# Altium schematic sheet NNP-DWG-165-001-000 BP2 Microcontroller Pg 3 of 6.SchDoc
size 431 x 279 mm; Organization: ORGANIZATION; Address1: ADDRESS 1; Address2: ADDRESS 2; Address3: ADDRESS 3; Address4: ADDRESS 4; Revision: -; SheetNumber: 4; SheetTotal: 6; ENG_APP_DATE: --/--/--; DSN_APP_DATE: --/--/--; CHK_APP_DATE: --/--/--
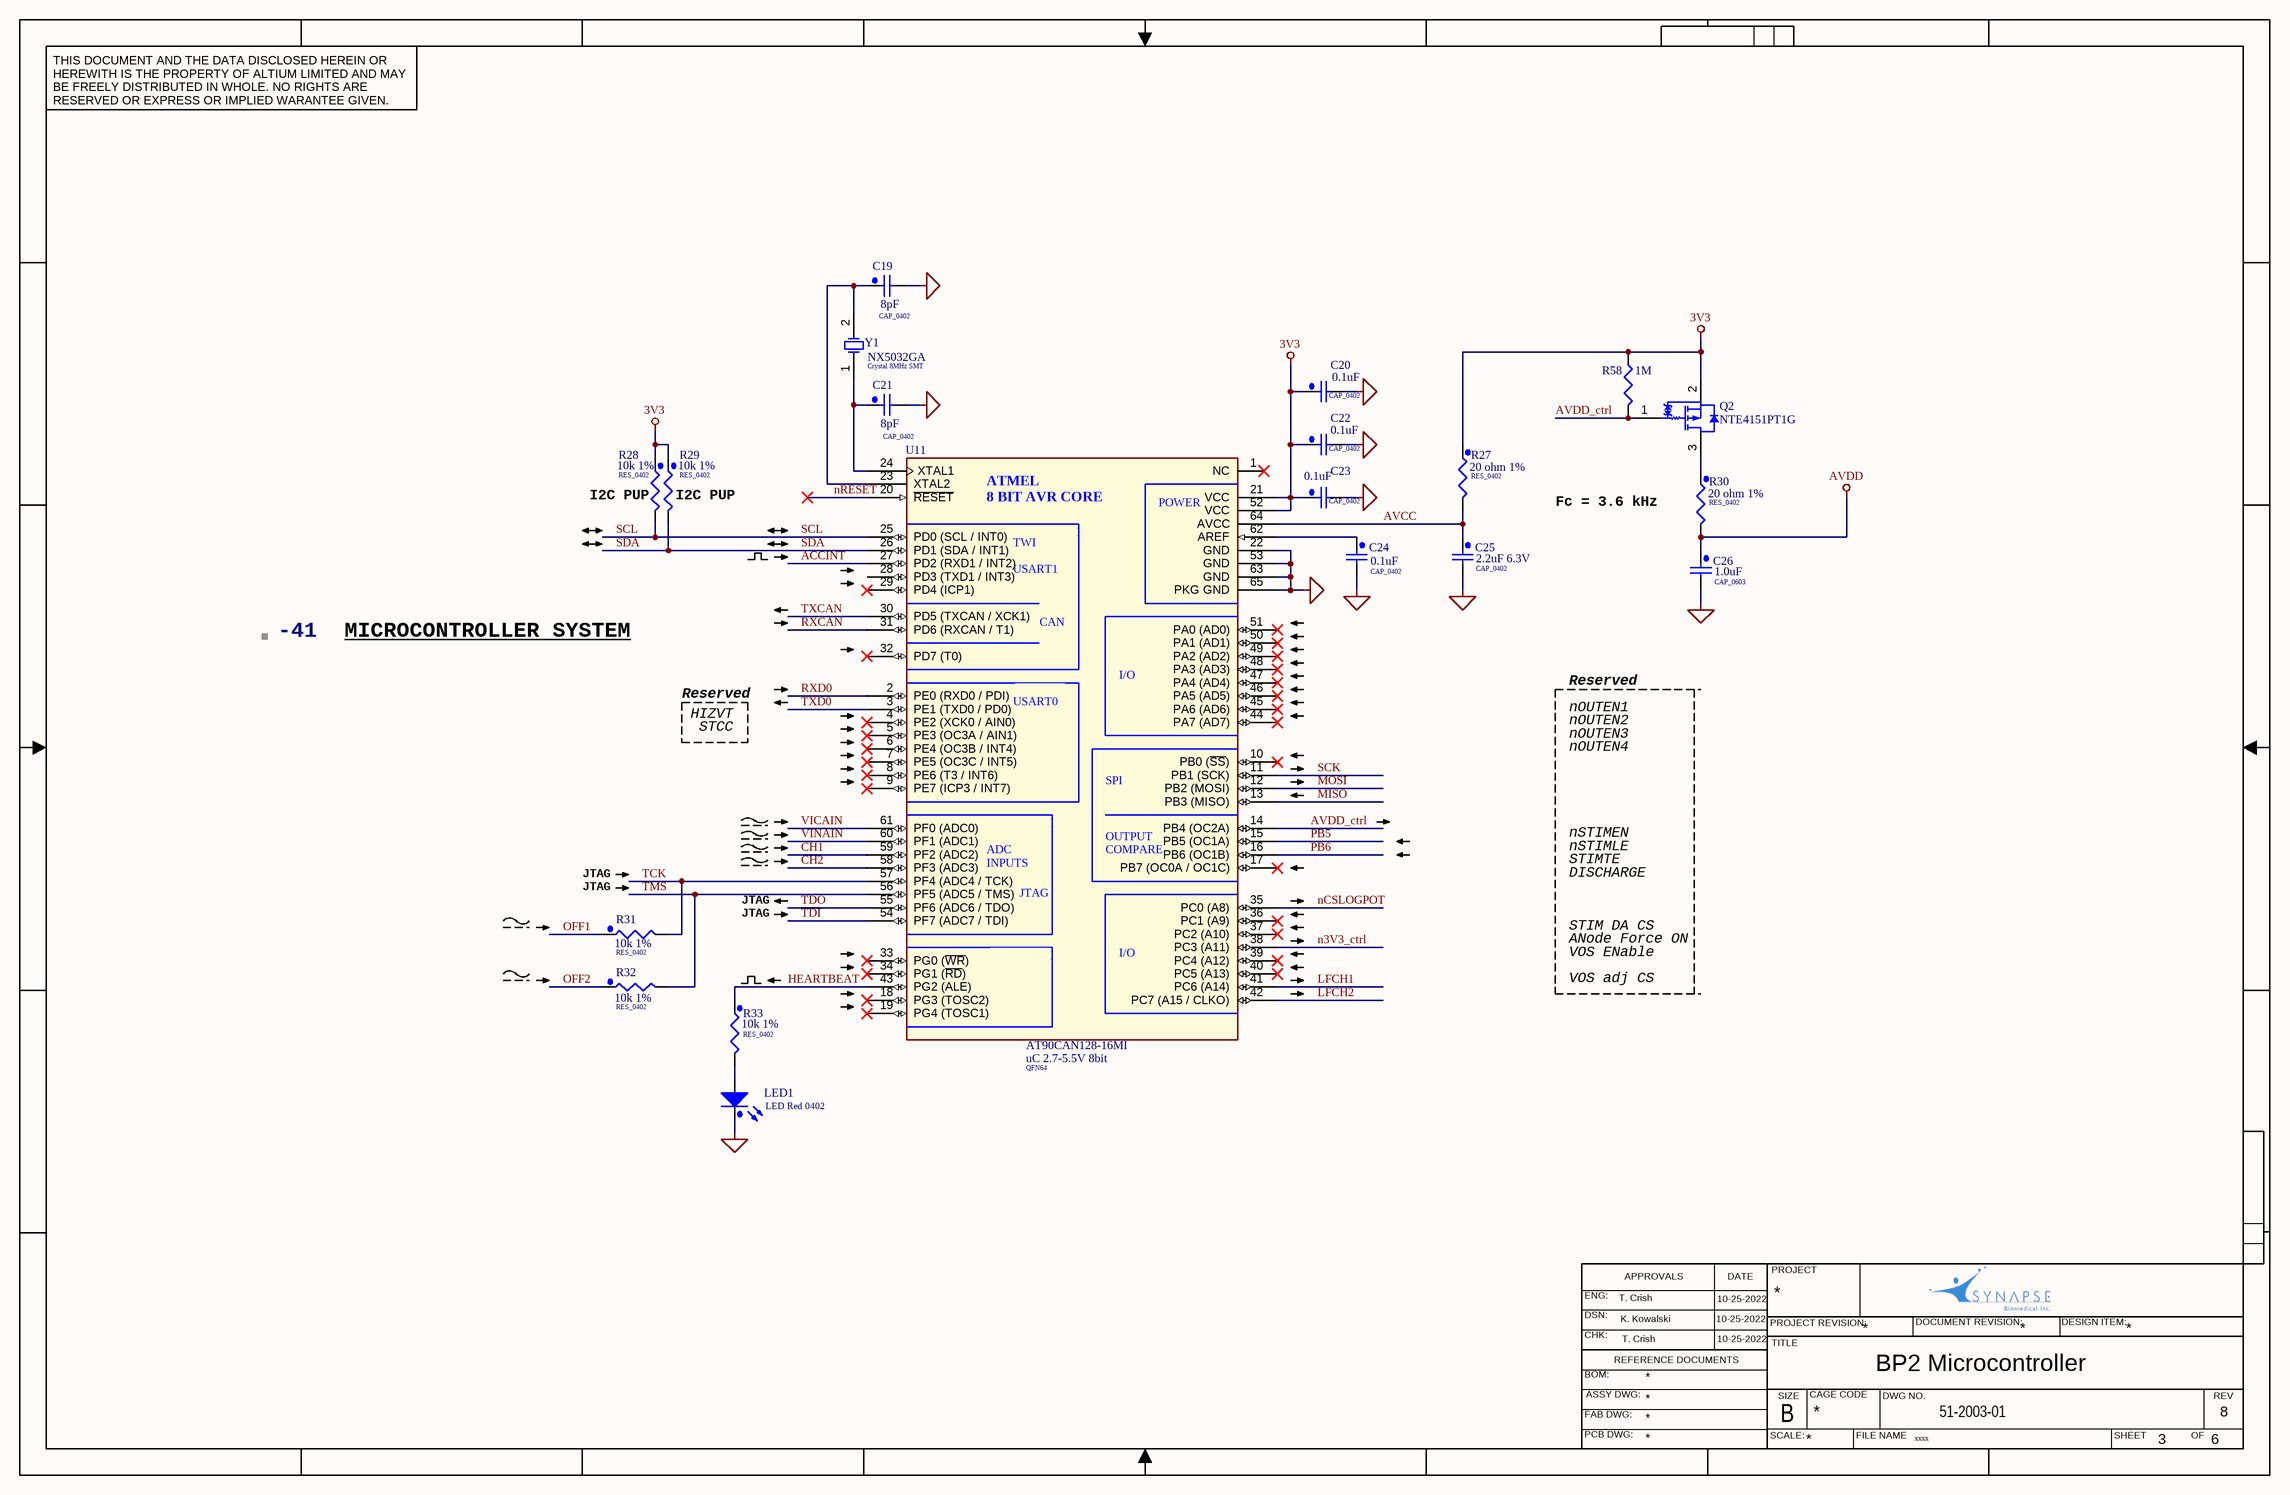
[diagram p0: NNP-DWG-165-001-000 BP2 Microcontroller Pg 3 of 6.SchDoc]

## Parts
-41  XDESCRIPTION: MICROCONTROLLER SYSTEM  (hidden comment: BOM_S1)  (graphical)
C19  value 8pF  [CAP_0402]  (hidden comment: C_8p_C0G_50_0402)
C20  value 0.1uF  [CAP_0402]  (hidden comment: C_100n_X7R_16_0402_10%)
C21  value 8pF  [CAP_0402]  (hidden comment: C_8p_C0G_50_0402)
C22  value 0.1uF  [CAP_0402]  (hidden comment: C_100n_X7R_16_0402_10%)
C23  value 0.1uF  [CAP_0402]  (hidden comment: C_100n_X7R_16_0402_10%)
C24  value 0.1uF  [CAP_0402]  (hidden comment: C_100n_X7R_16_0402_10%)
C25  value 2.2uF 6.3V  [CAP_0402]  (hidden comment: C_2u2_X5R_6V3_0402_20%)
C26  value 1.0uF  PackageDescription: CAP_0603  [CAP_0402]  (hidden comment: C_1u_X5R_6V3_0402_20%)
LED1  LED Red 0402  [LED_0402_RED]
Q2  NTE4151PT1G  [ONSC-SC-89-3-463C-02_V]
R27  value 20 ohm 1%  [RES_0402]  (hidden comment: R_20_0402)
R28  value 10k 1%  [RES_0402]  (hidden comment: R_10k_0402)
R29  value 10k 1%  [RES_0402]  (hidden comment: R_10k_0402)
R30  value 20 ohm 1%  [RES_0402]  (hidden comment: R_20_0402)
R31  value 10k 1%  [RES_0402]  (hidden comment: R_10k_0402)
R32  value 10k 1%  [RES_0402]  (hidden comment: R_10k_0402)
R33  value 10k 1%  [RES_0402]  (hidden comment: R_10k_0402)
R58  value 1M  [CHIP_0402N]  (hidden comment: 1M_0402 Resistor)
U11  uC 2.7-5.5V 8bit  [QFN64]
Y1  Crystal 8MHz SMT  [NX5032GA]

## Nets
3V3: C20.1 C22.1 C23.1 Q2.2(S) R27.1 R28.1 R29.1 R58.1 U11.21(VCC) U11.52(VCC)
AVDD: C26.1 R30.2
GND: C19.2 C20.2 C21.2 C22.2 C23.2 C24.2 C25.2 C26.2 LED1.1(C) U11.22(GND) U11.53(GND) U11.63(GND) U11.65(PKG_GND)
ACCINT: U11.27(PD2_(RXD1_/_INT2))
AVCC: C25.1 R27.2 U11.64(AVCC)
AVDD_ctrl: Q2.1(G) R58.2 U11.14(PB4_(OC2A))
CH1: U11.59(PF2_(ADC2))
CH2: U11.58(PF3_(ADC3))
HEARTBEAT: R33.1 U11.43(PG2_(ALE))
LFCH1: U11.41(PC6_(A14))
LFCH2: U11.42(PC7_(A15_/_CLKO))
MISO: U11.13(PB3_(MISO))
MOSI: U11.12(PB2_(MOSI))
n3V3_ctrl: U11.38(PC3_(A11))
nCSLOGPOT: U11.35(PC0_(A8))
nRESET: U11.20(~{RESET})
OFF1: R31.1
OFF2: R32.1
PB5: U11.15(PB5_(OC1A))
PB6: U11.16(PB6_(OC1B))
RXCAN: U11.31(PD6_(RXCAN_/_T1))
RXD0: U11.2(PE0_(RXD0_/_PDI))
SCK: U11.11(PB1_(SCK))
SCL: R28.2 U11.25(PD0_(SCL_/_INT0))
SDA: R29.2 U11.26(PD1_(SDA_/_INT1))
TCK: R31.2 U11.57(PF4_(ADC4_/_TCK))
TDI: U11.54(PF7_(ADC7_/_TDI))
TDO: U11.55(PF6_(ADC6_/_TDO))
TMS: R32.2 U11.56(PF5_(ADC5_/_TMS))
TXCAN: U11.30(PD5_(TXCAN_/_XCK1))
TXD0: U11.3(PE1_(TXD0_/_PD0))
VICAIN: U11.61(PF0_(ADC0))
VINAIN: U11.60(PF1_(ADC1))
NetC19_1: C19.1 U11.23(XTAL2) Y1.2(OSC2)
NetC21_1: C21.1 U11.24(XTAL1) Y1.1(OSC1)
NetC24_1: C24.1 U11.62(AREF)
NetLED1_2: LED1.2(A) R33.2
NetQ2_3: Q2.3(D) R30.1

Not connected (* = marked no-connect by the designer): U11 1(NC)* 4(PE2_(XCK0_/_AIN0))* 5(PE3_(OC3A_/_AIN1))* 6(PE4_(OC3B_/_INT4))* 7(PE5_(OC3C_/_INT5))* 8(PE6_(T3_/_INT6))* 9(PE7_(ICP3_/_INT7))* 10(PB0_(~{SS}))* 17(PB7_(OC0A_/_OC1C))* 18(PG3_(TOSC2))* 19(PG4_(TOSC1))* 28(PD3_(TXD1_/_INT3)) 29(PD4_(ICP1))* 32(PD7_(T0))* 33(PG0_(~{WR}))* 34(PG1_(~{RD}))* 36(PC1_(A9))* 37(PC2_(A10))* 39(PC4_(A12))* 40(PC5_(A13))* 44(PA7_(AD7))* 45(PA6_(AD6))* 46(PA5_(AD5))* 47(PA4_(AD4))* 48(PA3_(AD3))* 49(PA2_(AD2))* 50(PA1_(AD1))* 51(PA0_(AD0))*

## Notes on the sheet
- THIS DOCUMENT AND THE DATA DISCLOSED HEREIN OR HEREWITH IS THE PROPERTY OF ALTIUM LIMITED AND MAY BE FREELY DISTRIBUTED IN WHOLE. NO RIGHTS ARE RESERVED OR EXPRESS OR IMPLIED WARANTEE GIVEN.
- (near R28) I2C PUP
- (near R29) I2C PUP
- Fc = 3.6 kHz
- Reserved
- HIZVT
- STCC
- nOUTEN1
- nOUTEN2
- nOUTEN3
- nOUTEN4
- nSTIMEN
- (near R31) JTAG
- JTAG
- DISCHARGE
- STIMTE
- nSTIMLE
- VOS ENable
- ANode Force ON
- STIM DA CS
- VOS adj CS
- ENG:
- T. Crish
- APPROVALS
- 10-25-2022
- DATE
- PROJECT
- DSN:
- CHK:
- REFERENCE DOCUMENTS
- K. Kowalski
- PROJECT REVISION:
- TITLE
- *
- DOCUMENT REVISION:
- BP2 Microcontroller
- DESIGN ITEM:
- BOM:
- FAB DWG:
- PCB DWG:
- ASSY DWG:
- SCALE:
- SIZE
- B
- CAGE CODE
- FILE NAME
- DWG NO.
- 51-2003-01
- SHEET
- OF
- REV
- 8
- xxxx
- 3
- 6
- (in symbol AT90CAN128-16MI) ATMEL / 8 BIT AVR CORE; POWER; PORT D; TWI; USART1; PORT A; CAN; PORT E; I/O; USART0; PORT B; SPI; PORT F; OUTPUT COMPARE; ADC INPUTS; PORT C; JTAG; PORT G

## Library data of the parts
-41 = BOM_S1: BOM item small graphic
C19 C21 = ECJ-0EC1H080D: 8pF, 50V, C0G, 0402, 10%, RoHS; MFR: Murata Electronics North America; MPN: GRM1555C1H8R0DA01D; SBI: 53-0044; PackageDescription: CAP_0402; Supplier 1: Digi-Key; Supplier Part Number 1: 490-5867-6-ND
C20 C22-C24 = GRM155R71C104KA88D: 0.1uF, 16V, X7R, 0402, RoHS; MFR: Murata Electronics North America; SBI: 53-0040; PackageDescription: CAP_0402; Supplier 1: Digi-Key; Supplier Part Number 1: 490-3261-6-ND; MPN: GRM155R71C104KA88D
C25 = 6R3R07X225MV4T: 2.2uF, 6.3V, X5R, 0402, 20%, RoHS; MFR: Murata Electronics North America; MPN: GRM155R60J225ME15D; SBI: 53-0069; PackageDescription: CAP_0402; Supplier 1: Digi-Key; Supplier Part Number 1: 490-4519-6-ND
C26 = 6R3R07X225MV4T: 1.0uF, 6.3V, X5R, 20%, 0402, RoHS; MFR: TDK Corp; MPN: CGA3E1X7R1C105K080AC; SBI: 53-0078; Supplier 1: Digi-Key; Supplier Part Number 1: 445-12539
LED1 = SML-LX0402SIC-TR: LED, Red, 0402, 20mA ,2V, 140mcd, RoHS; MFR: Lumex; SBI: 53-0035; PackageDescription: 0402; Supplier 1: Digi-Key; Supplier Part Number 1: 67-1878-1-ND; MPN: SML-LX0402SIC-TR
Q2 = CMP-1058-00652-1: Small Signal MOSFET, -20 V, -760 mA, Single P-Channel, Gate Zener, 3-Pin SC-89, Pb-Free, Tape and Reel; Manufacturer: On Semiconductor; Channel Polarity: P Channel; Ciss Typ (pF): 156; Coss Typ (pF): 28; VGS(th) Max (V): 1.2; ID Max (A): 0.76; VGS Max (V): 6; V(BR)DSS Min (V): 20; Crss Typ (pF): 18; SBI: 54-0078; PartNumber: NTE4151PT1G; ComponentLink1URL: http://www.onsemi.com/; Mounting Technology: Surface Mount; Configuration: Single; ComponentLink3URL: http://www.onsemi.com/pub_link/Collateral/463C-02.PDF; ComponentLink3Description: Package Specification; ComponentLink1Description: Manufacturer URL; DatasheetVersion: Rev. 7; PackageVersion: Rev. C, 07/2003; ComponentLink2URL: http://www.onsemi.com/pub_link/Collateral/NTA4151P-D.PDF; RoHS: Pb-Free; PackageReference: SC-89-3-463C-02; Package Type: SC-89-3; PackageDescription: 3-Pin Small Outline Transistor, Body 1.6 x 0.85 mm, Pitch 0.5 mm; ComponentLink2Description: Datasheet; Packing: Tape and Reel; Supplier 1: Digi-Key; Supplier Part Number 1: NTE4151PT1GOSCT-ND
R27 R30 = CRCW040220R0FKED: 20 ohm, 1%, 0402, 1%, RoHS; MFR: Vishay; SBI: 53-0049-17; PackageDescription: RES_0402; Supplier 1: Digi-Key; Supplier Part Number 1: 541-20.0LCT-ND; MPN: CRCW040220R0FKED
R28 R29 R31-R33 = MCR01MZPF1002: 10.0k ohm, 1%, 1/16W, smd, 0402, RoHS; MFR: Vishay Dale; MPN: CRCW040210K0FKED; SBI: 53-0049-8; PackageDescription: RES_0402; Supplier 1: Digi-Key; Supplier Part Number 1: 541-10.0KLCT-ND
R58 = R_1M_0402: Resistor 1M 0402 1% 63mW; Manufacturer: Rohm; ManufacturerPN: MCR01MZPF1004; Supplier 1: Digi-Key; Supplier Part Number 1: RHM1.00MLCT-ND
U11 = AT90CAN128-16MI: uC, 2.7-5.5V, 8bit, QFN64, RoHS; MFR: Atmel; SBI: 54-0061; PackageDescription: QFN64; Supplier 1: Digi-Key; Supplier Part Number 1: AT90CAN128-16MU-ND; Value: *; MPN: AT90CAN128-16MI
Y1 = NX5032GA: MFR: NDK; SBI: 54-0073; Supplier 1: Digi-Key; Supplier Part Number 1: 644-1132-1-ND; VALUE: 8MHz; MPN: NX5032GA